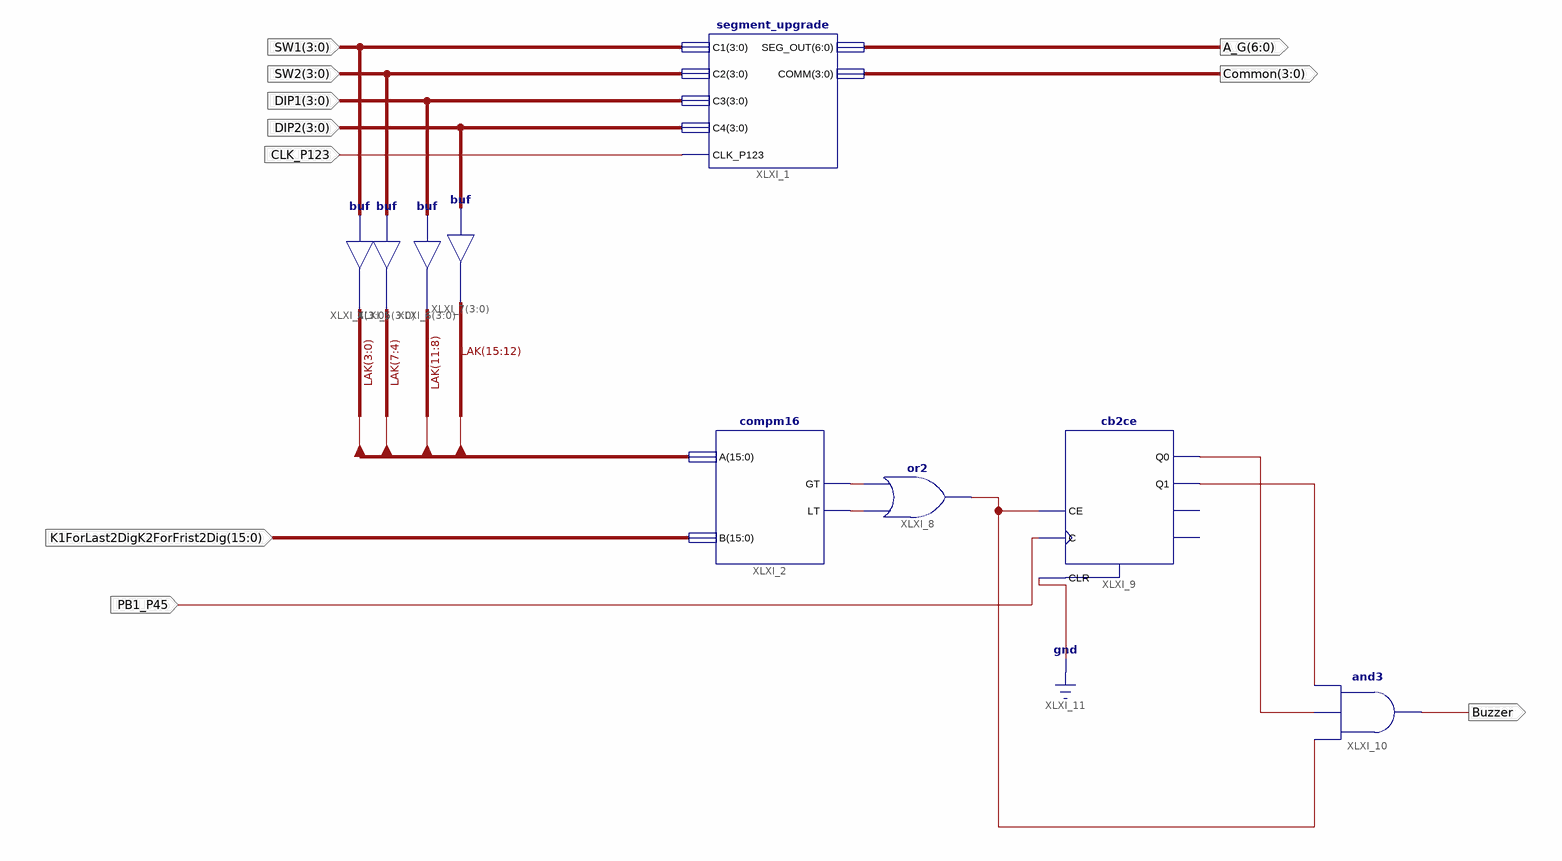
[diagram p0: schematic sheet 1]
// Xilinx ISE schematic mainControl.sch (spartan6) as structural Verilog: 9 symbols, 10 ports
module mainControl (
  input  [3:0] SW1,
  input  [3:0] SW2,
  input  [3:0] DIP1,
  input  [3:0] DIP2,
  input  CLK_P123,
  input  [15:0] K1ForLast2DigK2ForFrist2Dig,
  input  PB1_P45,
  output [6:0] A_G,
  output [3:0] Common,
  output Buzzer
);

  wire XLXN_15, XLXN_16, XLXN_19, XLXN_20, XLXN_21;
  wire [15:0] LAK;

  segment_upgrade XLXI_1 (.CLK_P123(CLK_P123), .C2(SW2), .C1(SW1), .C3(DIP1), .C4(DIP2), .SEG_OUT(A_G), .COMM(Common));
  compm16 XLXI_2 (.A(LAK), .B(K1ForLast2DigK2ForFrist2Dig), .GT(XLXN_16), .LT(XLXN_15));
  assign LAK[3:0] = SW1;  // buf XLXI_4[3..0], 4 bits wide
  assign LAK[7:4] = SW2;  // buf XLXI_5[3..0], 4 bits wide
  assign LAK[11:8] = DIP1;  // buf XLXI_6[3..0], 4 bits wide
  assign LAK[15:12] = DIP2;  // buf XLXI_7[3..0], 4 bits wide
  or XLXI_8 (XLXN_19, XLXN_15, XLXN_16);
  cb2ce XLXI_9 (.C(PB1_P45), .CE(XLXN_19), .CLR(1'b0), .Q0(XLXN_21), .Q1(XLXN_20));  // open: CEO, TC
  and XLXI_10 (Buzzer, XLXN_19, XLXN_21, XLXN_20);

  // Notes on the sheet:
  //   CLOCK_DIDICATED_ROUTE on signal K1ForLast2DigK2ForFrist2Dig(15:0) = TRUE
  //   CLOCK_DEDICATED_ROUTE on signal PB1_P45 = TRUE
endmodule
